# EAGLE design ICS40300-Silicon-Mic_Rev-D (EAGLE 8.5.0)
COMPANY: ADAFRUIT INDUSTRIES; DRAWN: KTOWN; REV: A
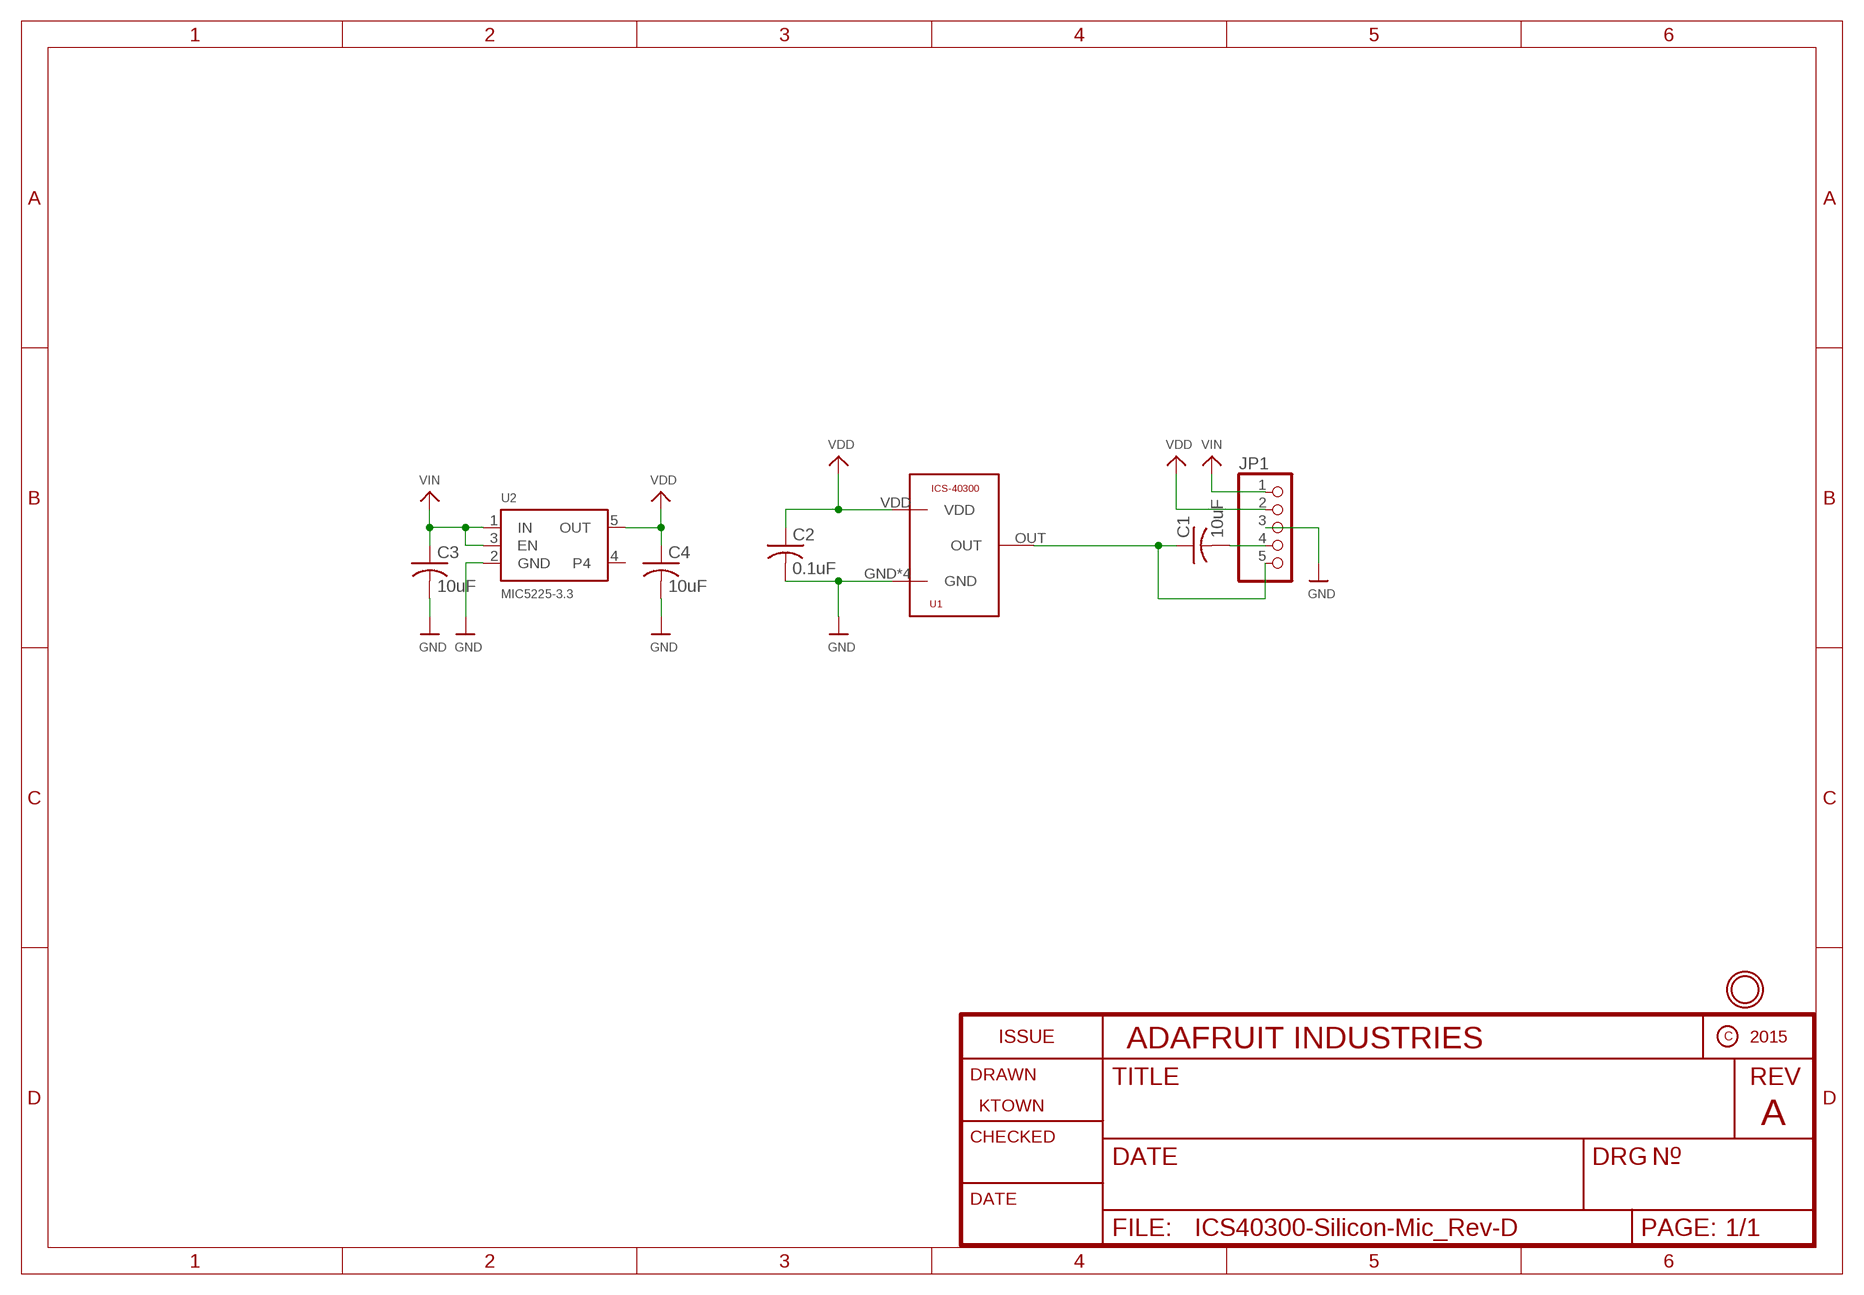
[diagram p0: schematic, sheet 1]

## Parts
C1  10uF  C-USC0805K  [C0805K]
C2  0.1uF  C-USC0805K  [C0805K]
C3  10uF  C-USC0805K  [C0805K]
C4  10uF  C-USC0805K  [C0805K]
JP1  HEADER-1X576MIL  [1X05_ROUND_76]
U1  ICS-40300  [ICS-40300]
U2  MIC5225-3.3  VREG_SOT23-5  [SOT23-5]
U$12  MOUNTINGHOLE2.5  [MOUNTINGHOLE_2.5_PLATED]

## Nets
GND: C2.2 C3.2 C4.2 JP1.3 U1.GND U1.GND1(GND) U1.GND2(GND) U1.GND3(GND) U2.2(GND)
N$1: C1.1 JP1.5 U1.OUT
N$2: C1.2 JP1.4
VDD: C2.1 C4.1 JP1.2 U1.VDD U2.5(OUT)
VIN: C3.1 JP1.1 U2.1(IN) U2.3(EN)
Unconnected: U2.4

## Library data of the parts
C1-C4 = adafruit:C-US: CAPACITOR, American symbol
JP1 = microbuilder:HEADER-1X5: PIN HEADER
U1 = CMU-ArtFab:ICS-40300
U2 = microbuilder:VREG_SOT23-5: SOT23-5 Fixed Voltage Regulators Part Current Out V Out V In V Dropout θJA (°C/W) TJ (°C) Digikey Part No. ADP121 150mA 3.3V 3.4-5.5V 0.09V @ 150mA -- -- ADP121-AUJZ33R7CT-ND ADP121 150mA 3.0V 3.1-5.5V 0.09V @ 150mA -- -- ADP121-AUJZ30R7CT-ND ADP122 300mA 3.3V 3.4-5.5V 0.085V @ 300mA -- -- ADP122AUJZ-3.3-R7CT-ND ADP1712 300mA 3.3V 3.5-5.5V 0.17V @ 300mA -- -- ADP1712AUJZ-3.3-R7TR-ND AP7311 (Low Cost) 150mA 3.3V 3.5-6V 0.15V @ 150mA -- -- AP7311-33WG-7DICT-ND LD39015M18R 150mA 1.8V 1.9V-5.5V 0.08V @ 100mA -- -- 497-6977-1-ND LP2985A-33DBVR 150mA 3.3V 3.3-16V 0.28V @ 150mA 206 150 296-18479-1-ND MCP1824T-3302E/OT 300mA 3.3V 3.5V-6V 0.2V @ 300mA -- -- MCP1824T-3302E/OTCT-ND MIC5205-2.5YM5 TR 150mA 2.5V 2.7-16V 0.165V @ 150mA -- -- 576-1257-2-ND MIC5205-3.0YM5 TR 150mA 3.0V 3.2V-16V 0.165V @ 150mA -- -- 576-1258-2-ND MIC5205-3.3YM5 TR 150mA 3.3V 3.5V-16V 0.165V @ 150mA -- -- 576-1259-2-ND TPS780330220 150mA 3.3V+2.2V 3.6-5.5V 250mV Max -- -- 296-23332-1-ND TDA3663/N1,135 100mA 3.3V 3.5-45V 0.18V @ 50mA -- -- 568-5343-1-ND Max operating temp can be calculated using θJA, TJ (max junction temperature), and power in watts. Set the "Maximum Ambient Temperature" until it reaches TJ ("Max Junction Temperature"), which is the absolute limit for safe use of the regulator: Heat Sink Temperature Calculator <http://www.daycounter.com/Calculators/Heat-Sink-Temperature-Calculator.phtml> For example, With 12V source into a 3.3V LP2985 and a 30mA load, we are dissipating (12V-3.3V) * 0.03A = 0.261W. With a θJA of 206 °C/W, a TJ of 150°C, and 261mW we can safely use the chip without a heat sink up to 75°C (=147.1°C Junction Temperature).
U$12 = microbuilder:MOUNTINGHOLE: Mounting Hole For #2 screws (0.086"/2.18mm width, 0.094"/2.4mm hole) use 2.5mm; BOM: EXCLUDE

## Board
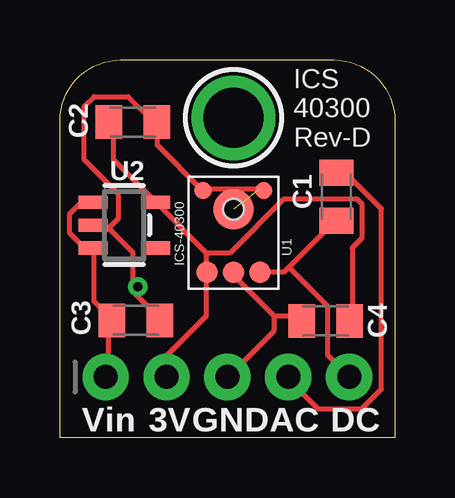
[diagram p1: board, top side]
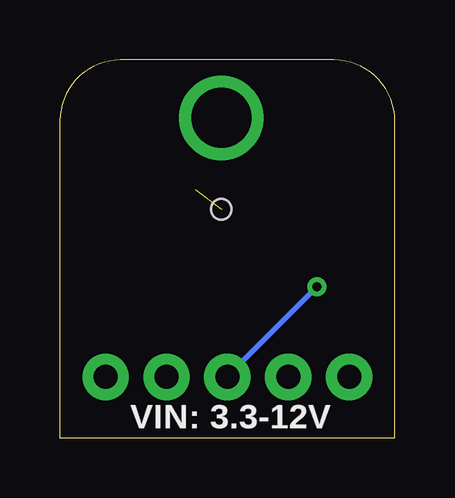
[diagram p2: board, bottom side, seen from below]

Size 13.97 x 15.75 mm. Coordinates in mm from the lower left corner, seen from the top.
Outline: 0,0 0,13.21 arc-90 2.54,15.75 11.43,15.75 arc-90 13.97,13.21 13.97,0 0,0
Copper layers (1*16): Top 0.035mm / dielectric 1.5mm / Bottom 0.035mm
Design rules "adafruit": minimum track width 8mil, minimum drill 15.5mil, track to track 8mil, track to pad 8mil, pad to pad 8mil, via to via 8mil, smd to smd 8mil, copper to edge 10mil, drill to drill 8mil, minimum pad ring 10mil, minimum via ring 8mil, stop-mask expansion 2mil, vias tented up to drill 20mil, thermal gap 10mil

### Footprints (pad centres in the part's own frame; a part is rotated, then mirrored left to right if it is on the bottom)
C0805K = smd 1.1 x 1.4: 1 -1,0; 2 1,0
1X05_ROUND_76 = drill 1 pad 1.93: 1 -5.08,0; 2 -2.54,0; 3 0,0; 4 2.54,0; 5 5.08,0
ICS-40300 = smd 0.9 x 0.9: GND -2.62,0; OUT -2.62,-1.1; VDD -2.62,1.1 | smd 0.7 x 0.7: GND1 0.79,1.27; GND2 0.79,-1.27 | smd 1.68 x 1.68: GND3 0,0 | hole 0.85: 0,0
SOT23-5 = smd 0.55 x 1.2: 1 -0.95,-1.3; 2 0,-1.3; 3 0.95,-1.3; 4 0.95,1.3; 5 -0.95,1.3
MOUNTINGHOLE_2.5_PLATED = drill 2.5 pad 3.2: P$1 0,0

### Placement (x,y rotation side)
C1  11.53,10.05 90 top
C2  3.04,13.16 0 top
C3  3.16,4.9 0 top
C4  11.08,4.88 180 top
JP1  6.99,2.54 0 top
U1  7.24,9.53 90 top
U2  2.68,8.87 270 top
U$12  7.24,13.34 0 top

### Tracks (layer width: path | path; a pad name or v marks a point on that pad's centre or on a via)
GND  (via drill 0.39)  (1 unrouted)
  Top 0.203: 8.94,5.08 7.32,6.71 U1.GND | 8.94,5.08 9.96,5.08 C4.2 | 8.94,5.08 8.94,4.47 7.11,2.64 JP1.3 | U1.GND2 8.33,10.36 6.1,10.36 U1.GND1 5.89,10.36 4.06,12.19 4.06,13.01 C2.2 3.86,13.21 2.85,14.22 1.42,14.22 1.02,13.82 1.02,11.58 2.44,10.16 2.44,9.14 2.03,8.74 | 2.03,8.74 1.42,8.74 U2.2 | 2.03,8.74 3.05,7.72 3.05,6.3 | 3.05,6.3 3.05,6.1 4.06,5.08 C3.2 | 3.05,6.3 v3.25,6.3
  Bottom 0.203: v3.25,6.3 6.91,2.64 JP1.3
N$1
  Top 0.203: 9.55,7.11 11.38,8.94 C1.1 | 9.55,7.11 9.35,6.91 8.53,6.91 U1.OUT | 9.55,7.11 11.18,5.49 11.18,3.45 11.99,2.64 JP1.5
N$2
  Top 0.203: C1.2 11.58,10.97 11.99,10.97 13.41,9.55 13.41,2.03 12.6,1.22 10.77,1.22 9.55,2.44 JP1.4
VDD
  Top 0.203: 6.1,7.72 6.1,6.91 U1.VDD 6.1,6.71 6.1,5.08 4.47,3.45 4.47,2.64 JP1.2 | 6.1,7.72 4.06,9.75 U2.5 3.86,9.96 2.23,11.58 2.23,13.01 C2.1 | 6.1,7.72 7.11,7.72 9.35,9.96 12.39,9.96 12.6,9.75 12.6,8.33 12.19,7.92 12.19,5.08 C4.1
VIN
  Top 0.203: U2.1 1.22,9.75 0.81,9.75 0.41,9.35 0.41,8.53 1.22,7.72 U2.3 1.42,7.72 1.42,5.69 2.03,5.08 C3.1 2.03,4.88 2.03,2.64 JP1.1

### Text on the board
tPlace: ICS / 40300 / Rev-D | Vin | 3V | GND | AC | DC
bPlace: VIN: 3.3-12V